# EasyEDA schematic SCH_浩盛单路电机开发板V2.0.json
TITLE: 浩盛单路电机开发板V2.0; REV: 1.0; Date: 2025-05-28; Sheet: 1/1; Drawn By: 嵌入式软件工程师YHR; Company: Your Company
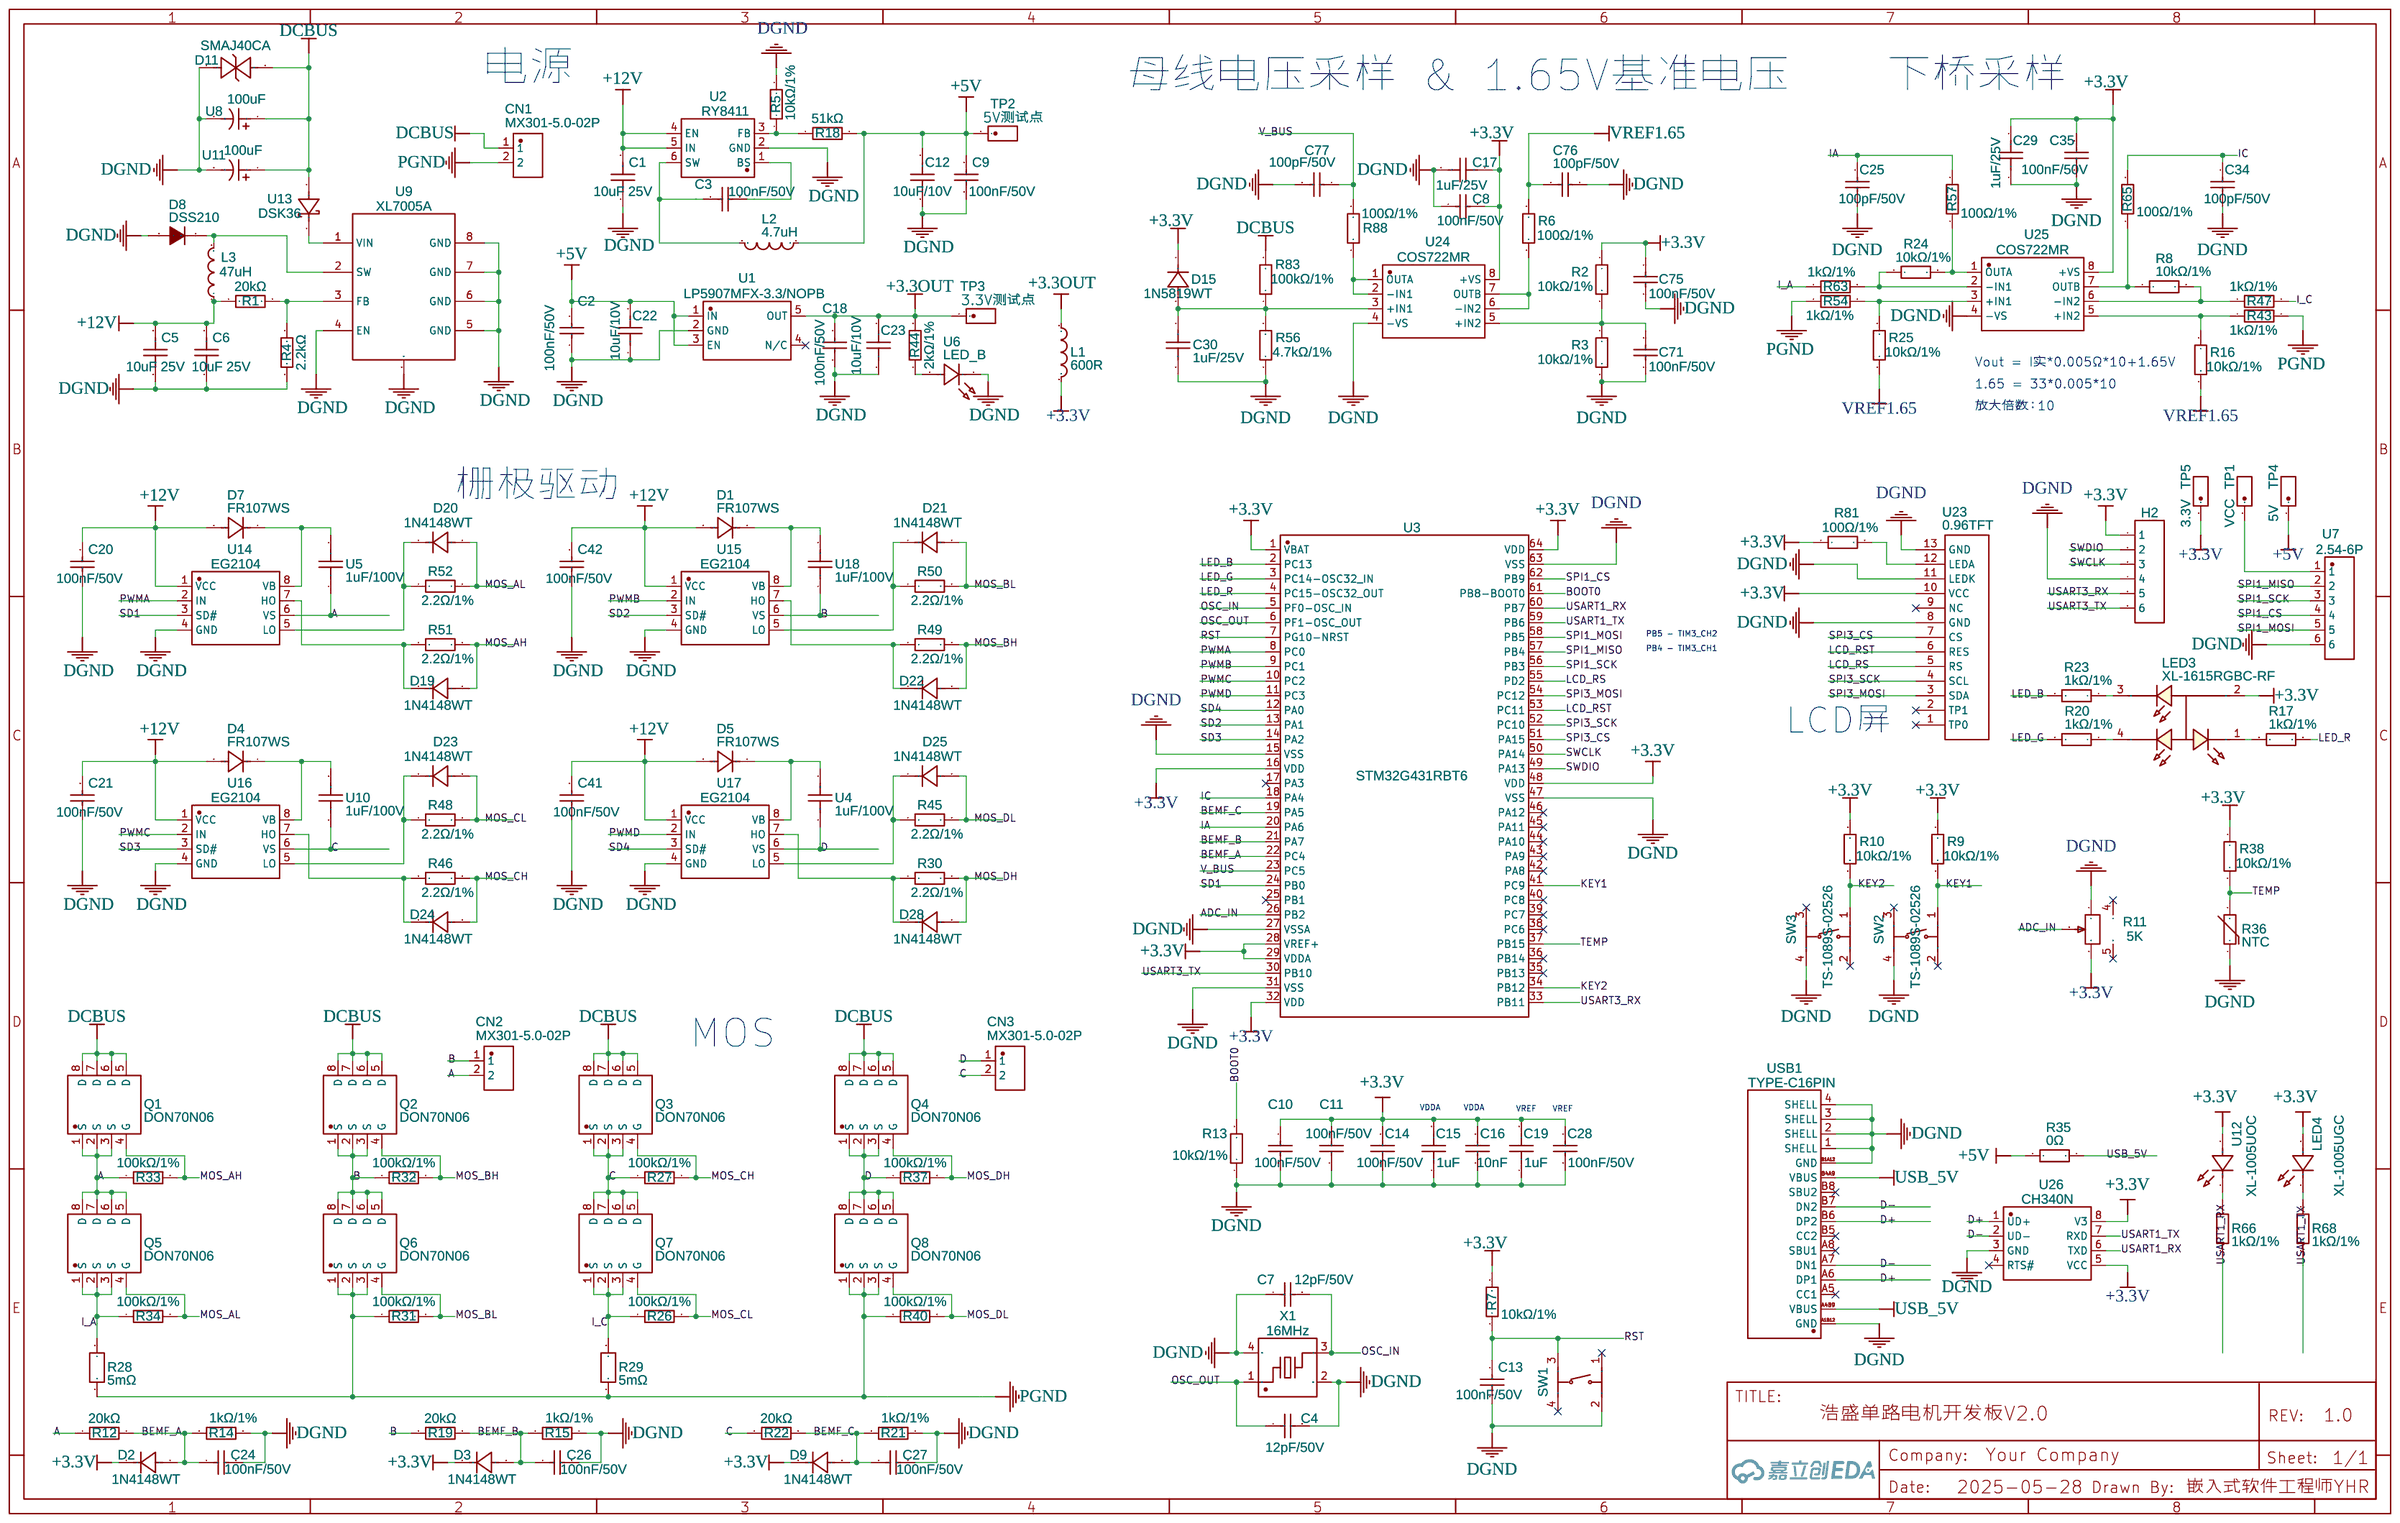
[diagram p0: schematic sheet]

## Parts
C1  10uF 25V  [C0603]
C2  100nF/50V  [MY_0402]
C3  100nF/50V  [MY_0402]
C4  12pF/50V  [MY_0402]
C5  10uF 25V  [C0603]
C6  10uF 25V  [C0603]
C7  12pF/50V  [MY_0402]
C8  100nF/50V  [MY_0402]
C9  100nF/50V  [MY_0402]
C10  100nF/50V  [MY_0402]
C11  100nF/50V  [MY_0402]
C12  10uF/10V  [MY_0402]
C13  100nF/50V  [MY_0402]
C14  100nF/50V  [MY_0402]
C15  1uF  [MY_0402]
C16  10nF  [MY_0402]
C17  1uF/25V  [MY_0402]
C18  100nF/50V  [MY_0402]
C19  1uF  [MY_0402]
C20  100nF/50V  [MY_0402]
C21  100nF/50V  [MY_0402]
C22  10uF/10V  [MY_0402]
C23  10uF/10V  [MY_0402]
C24  100nF/50V  [MY_0402]
C25  100pF/50V  [MY_0402]
C26  100nF/50V  [MY_0402]
C27  100nF/50V  [MY_0402]
C28  100nF/50V  [MY_0402]
C29  1uF/25V  [MY_0402]
C30  1uF/25V  [MY_0402]
C34  100pF/50V  [MY_0402]
C35  100nF/50V  [MY_0402]
C41  100nF/50V  [MY_0402]
C42  100nF/50V  [MY_0402]
C71  100nF/50V  [MY_0402]
C75  100nF/50V  [MY_0402]
C76  100pF/50V  [MY_0402]
C77  100pF/50V  [MY_0402]
CN1  MX301-5.0-02P  [CONN-TH_2P-P5.0-MX301-5.0-02P-BU01-CU-Y-A]
CN2  MX301-5.0-02P  [CONN-TH_2P-P5.0-MX301-5.0-02P-BU01-CU-Y-A]
CN3  MX301-5.0-02P  [CONN-TH_2P-P5.0-MX301-5.0-02P-BU01-CU-Y-A]
D1  FR107WS  [SOD-323_L1.6-W1.3-LS2.7-RD]
D2  1N4148WT  [SOD-523_L1.2-W0.8-LS1.6-RD]
D3  1N4148WT  [SOD-523_L1.2-W0.8-LS1.6-RD]
D4  FR107WS  [SOD-323_L1.6-W1.3-LS2.7-RD]
D5  FR107WS  [SOD-323_L1.6-W1.3-LS2.7-RD]
D7  FR107WS  [SOD-323_L1.6-W1.3-LS2.7-RD]
D8  DSS210  [SOD-123_L2.8-W1.8-LS3.7-FD]
D9  1N4148WT  [SOD-523_L1.2-W0.8-LS1.6-RD]
D11  SMAJ40CA  [SMA_L4.3-W2.6-LS5.0-BI]
D15  1N5819WT  [SOD-523_L1.2-W0.8-LS1.6-RD]
D19  1N4148WT  [SOD-523_L1.2-W0.8-LS1.6-RD]
D20  1N4148WT  [SOD-523_L1.2-W0.8-LS1.6-RD]
D21  1N4148WT  [SOD-523_L1.2-W0.8-LS1.6-RD]
D22  1N4148WT  [SOD-523_L1.2-W0.8-LS1.6-RD]
D23  1N4148WT  [SOD-523_L1.2-W0.8-LS1.6-RD]
D24  1N4148WT  [SOD-523_L1.2-W0.8-LS1.6-RD]
D25  1N4148WT  [SOD-523_L1.2-W0.8-LS1.6-RD]
D28  1N4148WT  [SOD-523_L1.2-W0.8-LS1.6-RD]
H2  Header-Male-2.54_1x6  [HDR-TH_6P-P2.54-V-M-1]
L1  600R  [MY_0402]
L2  4.7uH  [IND-SMD_L4.0-W4.0]
L3  47uH  [IND-SMD_L4.0-W4.0]
LED3  XL-1615RGBC-RF  [LED-ARRAY-SMD_4P-L1.6-W1.5-BR_XL-1615RGBC-RF]
LED4  XL-1005UGC  [LED0402-RD_GREEN]
Q1  DON70N06  [DFN-8_L5.8-W4.9-P1.27-LS6.1-BL-2]
Q2  DON70N06  [DFN-8_L5.8-W4.9-P1.27-LS6.1-BL-2]
Q3  DON70N06  [DFN-8_L5.8-W4.9-P1.27-LS6.1-BL-2]
Q4  DON70N06  [DFN-8_L5.8-W4.9-P1.27-LS6.1-BL-2]
Q5  DON70N06  [DFN-8_L5.8-W4.9-P1.27-LS6.1-BL-2]
Q6  DON70N06  [DFN-8_L5.8-W4.9-P1.27-LS6.1-BL-2]
Q7  DON70N06  [DFN-8_L5.8-W4.9-P1.27-LS6.1-BL-2]
Q8  DON70N06  [DFN-8_L5.8-W4.9-P1.27-LS6.1-BL-2]
R1  20kΩ  [MY_0402]
R2  10kΩ/1%  [MY_0402]
R3  10kΩ/1%  [MY_0402]
R4  2.2kΩ  [MY_0402]
R5  10kΩ/1%  [MY_0402]
R6  100Ω/1%  [MY_0402]
R7  10kΩ/1%  [MY_0402]
R8  10kΩ/1%  [MY_0402]
R9  10kΩ/1%  [MY_0402]
R10  10kΩ/1%  [MY_0402]
R11  5K  [R1001G]
R12  20kΩ  [MY_0402]
R13  10kΩ/1%  [MY_0402]
R14  1kΩ/1%  [MY_0402]
R15  1kΩ/1%  [MY_0402]
R16  10kΩ/1%  [MY_0402]
R17  1kΩ/1%  [MY_0402]
R18  51kΩ  [MY_0402]
R19  20kΩ  [MY_0402]
R20  1kΩ/1%  [MY_0402]
R21  1kΩ/1%  [MY_0402]
R22  20kΩ  [MY_0402]
R23  1kΩ/1%  [MY_0402]
R24  10kΩ/1%  [MY_0402]
R25  10kΩ/1%  [MY_0402]
R26  100kΩ/1%  [MY_0402]
R27  100kΩ/1%  [MY_0402]
R28  5mΩ  [RES-SMD_L6.4-W3.2-1]
R29  5mΩ  [RES-SMD_L6.4-W3.2-1]
R30  2.2Ω/1%  [MY_0402]
R31  100kΩ/1%  [MY_0402]
R32  100kΩ/1%  [MY_0402]
R33  100kΩ/1%  [MY_0402]
R34  100kΩ/1%  [MY_0402]
R35  0Ω  [R0402]
R36  NTC  [MY_0402]
R37  100kΩ/1%  [MY_0402]
R38  10kΩ/1%  [MY_0402]
R40  100kΩ/1%  [MY_0402]
R43  1kΩ/1%  [MY_0402]
R44  2kΩ/1%  [MY_0402]
R45  2.2Ω/1%  [MY_0402]
R46  2.2Ω/1%  [MY_0402]
R47  1kΩ/1%  [MY_0402]
R48  2.2Ω/1%  [MY_0402]
R49  2.2Ω/1%  [MY_0402]
R50  2.2Ω/1%  [MY_0402]
R51  2.2Ω/1%  [MY_0402]
R52  2.2Ω/1%  [MY_0402]
R54  1kΩ/1%  [MY_0402]
R56  4.7kΩ/1%  [MY_0402]
R57  100Ω/1%  [MY_0402]
R63  1kΩ/1%  [MY_0402]
R65  100Ω/1%  [MY_0402]
R66  1kΩ/1%  [MY_0402]
R68  1kΩ/1%  [MY_0402]
R81  100Ω/1%  [MY_0402]
R83  100kΩ/1%  [MY_0402]
R88  100Ω/1%  [MY_0402]
SW1  TS-1089S-02526  [SW-SMD_4P-L4.2-W3.3-P2.15-LS5.1]
SW2  TS-1089S-02526  [SW-SMD_4P-L4.2-W3.3-P2.15-LS5.1]
SW3  TS-1089S-02526  [SW-SMD_4P-L4.2-W3.3-P2.15-LS5.1]
TP1  VCC  [测试点]
TP2  5V测试点  [测试点]
TP3  3.3V测试点  [测试点]
TP4  5V  [测试点]
TP5  3.3V  [测试点]
U1  LP5907MFX-3.3/NOPB  [SOT-23-5_L3.0-W1.7-P0.95-LS2.8-BR]
U2  RY8411  [SOT-23-6_L2.9-W1.6-P0.95-LS2.8-TL]
U3  STM32G431RBT6  [LQFP-64_L10.0-W10.0-P0.50-LS12.0-BL]
U4  1uF/100V  [C0805]
U5  1uF/100V  [C0805]
U6  LED_B  [LED0402-RD]
U7  2.54-6P  [CONN-TH_DB125-2.54-6P-GN]
U8  100uF  [CAP-SMD_BD8.0-L8.3-W8.3-LS9.3-FD-1]
U9  XL7005A  [SOIC-8_L4.9-W3.9-P1.27-LS6.0-BL-EP3.1-1]
U10  1uF/100V  [C0805]
U11  100uF  [CAP-SMD_BD8.0-L8.3-W8.3-LS9.3-FD-1]
U12  XL-1005UOC  [LED0402-RD_ORANGE]
U13  DSK36  [SOD-123FL_L2.8-W1.9-LS3.7-RD]
U14  EG2104  [SOP-8_L5.0-W4.0-P1.27-LS6.2-BL]
U15  EG2104  [SOP-8_L5.0-W4.0-P1.27-LS6.2-BL]
U16  EG2104  [SOP-8_L5.0-W4.0-P1.27-LS6.2-BL]
U17  EG2104  [SOP-8_L5.0-W4.0-P1.27-LS6.2-BL]
U18  1uF/100V  [C0805]
U23  0.96TFT  [0.96寸TFT]
U24  COS722MR  [MSOP-8_L3.0-W3.0-P0.65-LS4.9-BL-1]
U25  COS722MR  [MSOP-8_L3.0-W3.0-P0.65-LS4.9-BL-1]
U26  CH340N  [SOP-8_L5.0-W4.0-P1.27-LS6.0-BL]
USB1  TYPE-C16PIN  [USB-C-SMD_TYPE-C16PIN]
X1  16MHz  [CRYSTAL-SMD_4P-L2.0-W1.6-BL]

## Library data of the parts
C1 C5 C6 = HGC0603R5106M250NTHJ: Supplier: LCSC; Supplier Part: C7472961; Manufacturer: Chinocera(华瓷); Contributor: lcsc; JLCPCB Part Class: Extended Part
C2 C3 C8-C11 C13 C14 C18 C20 C21 C24 C26-C28 C35 C41 C42 C71 C75 = CC0402KRX7R9BB104: Contributor: LCSC; Supplier: LCSC; Supplier Part: C131394; Manufacturer: YAGEO(国巨); JLCPCB Part Class: Extended Part
C4 C7 = CC0402JRNPO9BN120: Supplier: LCSC; Manufacturer: YAGEO(国巨); Supplier Part: C106201; JLCPCB Part Class: Extended Part
C12 C22 C23 = CL05A106MP5NUNC_C315248: Contributor: LCSC; Supplier: LCSC; Supplier Part: C315248; Manufacturer: SAMSUNG(三星); Manufacturer Part: CL05A106MP5NUNC; JLCPCB Part Class: Extended Part
C15 C19 = CC0402KRX5R8BB105: Contributor: LCSC; Supplier: LCSC; Supplier Part: C326568; Manufacturer: YAGEO(国巨); JLCPCB Part Class: Extended Part
C16 = CC0402KRX7R9BB103: Supplier: LCSC; Manufacturer: YAGEO(国巨); Supplier Part: C60133; JLCPCB Part Class: Extended Part
C17 C29 C30 = CL05A105KA5NQNC: Supplier: LCSC; Manufacturer: SAMSUNG(三星); Supplier Part: C52923
C25 C34 C76 C77 = CC0402JRNPO9BN101: Supplier: LCSC; Manufacturer: YAGEO(国巨); Supplier Part: C106200; JLCPCB Part Class: Extended Part
CN1-CN3 = MX301-5.0-02P-BU01-CU-Y-A: Supplier: LCSC; Supplier Part: C5188422; Manufacturer: MAX(迈旭); Manufacturer Part: MX301-5.0-02P-BU01-Cu-Y-A; Contributor: lcsc; JLCPCB Part Class: Extended Part
D1 D4 D5 D7 = FR107WS_C3013756: Contributor: lcsc; Supplier: LCSC; Supplier Part: C3013756; Manufacturer: YFW(佑风微); JLCPCB Part Class: Extended Part
D2 D3 D9 D19-D25 D28 = 1N4148WT_C708767: Supplier: LCSC; Supplier Part: C708767; Manufacturer: TECH PUBLIC(台舟); Contributor: LCSC; JLCPCB Part Class: Extended Part
D8 = DSS210: Contributor: LCSC; Supplier: LCSC; Supplier Part: C511868; Manufacturer: BORN(伯恩半导体); JLCPCB Part Class: Extended Part
D11 = SMAJ40CA_C19077552: Supplier: LCSC; Supplier Part: C19077552; Manufacturer: 宏嘉诚; Contributor: lcsc; JLCPCB Part Class: Extended Part
D15 = 1N5819WT_C5451630: Supplier: LCSC; Supplier Part: C5451630; Manufacturer: HXY MOSFET(华轩阳电子); JLCPCB Part Class: Extended Part; Contributor: lcsc
H2 = Header-Male-2.54_1x6: Supplier: LCSC; Manufacturer: BOOMELE(博穆精密); Manufacturer Part: 2.54-1x6P直针; Supplier Part: C37208; JLCPCB Part Class: Extended Part
L1 = BLM15AG601SN1D: Supplier: LCSC; Manufacturer: muRata(村田); Supplier Part: C76884; JLCPCB Part Class: Extended Part
L2 = FHD4020S-4R7MT: Contributor: LCSC; Supplier: LCSC; Supplier Part: C602031; Manufacturer: cjiang(长江微电); JLCPCB Part Class: Extended Part
L3 = FHD4020S-470MT: Contributor: LCSC; Supplier: LCSC; Supplier Part: C843300; Manufacturer: cjiang(长江微电); JLCPCB Part Class: Extended Part
LED3 = XL-1615RGBC-RF: Contributor: LCSC; Supplier: LCSC; Supplier Part: C965840; Manufacturer: XINGLIGHT(成兴光); JLCPCB Part Class: Extended Part
LED4 = XL-1005UGC: Contributor: LCSC; Supplier: LCSC; Supplier Part: C965793; Manufacturer: XINGLIGHT(成兴光); JLCPCB Part Class: Extended Part
Q1-Q8 = DON70N06: Supplier: LCSC; Supplier Part: C41384263; Manufacturer: DOINGTER(杜因特); Contributor: lcsc; JLCPCB Part Class: Extended Part
R1 R12 R19 R22 = RC0402FR-0720KL: Supplier: LCSC; Manufacturer: YAGEO(国巨); Supplier Part: C93942; JLCPCB Part Class: Extended Part
R2 R3 R5 R7-R10 R13 R16 R24 R25 R38 = RC0402FR-0710KL: Supplier: LCSC; Manufacturer: YAGEO(国巨); Supplier Part: C60490; JLCPCB Part Class: Extended Part
R4 = RC0402FR-072K2L: Supplier: LCSC; Manufacturer: YAGEO(国巨); Supplier Part: C114762; JLCPCB Part Class: Extended Part
R6 R57 R65 R81 R88 = RC0402FR-07100RL: Supplier: LCSC; Manufacturer: YAGEO(国巨); Supplier Part: C106232; JLCPCB Part Class: Extended Part
R11 = R1001-B502-3P 18mm: Supplier: LCSC; Manufacturer: null; Supplier Part: C10529; JLCPCB Part Class: Extended Part
R14 R15 R17 R20 R21 R23 R66 R68 = RC0402FR-071KL: Supplier: LCSC; Manufacturer: YAGEO(国巨); Supplier Part: C106235; JLCPCB Part Class: Extended Part
R18 = RC0402FR-0751KL: Supplier: LCSC; Manufacturer: YAGEO(国巨); Supplier Part: C107229; JLCPCB Part Class: Extended Part
R26 R27 R31-R34 R37 R40 R83 = RC0402FR-07100KL: Supplier: LCSC; Manufacturer: YAGEO(国巨); Supplier Part: C60491; JLCPCB Part Class: Extended Part
R28 R29 = HOJLR2512-3W-5MR-1%: Contributor: LCSC; Supplier: LCSC; Supplier Part: C2903482; Manufacturer: Milliohm(毫欧); Manufacturer Part: HoJLR2512-3W-5mR-1%; JLCPCB Part Class: Extended Part
R30 R45 R46 R48-R52 = RC0402FR-072R2L: Contributor: LCSC; Supplier: LCSC; Supplier Part: C327251; Manufacturer: YAGEO(国巨); JLCPCB Part Class: Extended Part
R35 = 0402WGF0000TCE: Supplier: LCSC; Manufacturer: UNI-ROYAL(厚声); Supplier Part: C17168; JLCPCB Part Class: Basic Part
R36 = NCP15XH103F03RC: Supplier: LCSC; Manufacturer: muRata(村田); Supplier Part: C77131; JLCPCB Part Class: Extended Part
R43 R47 R54 R63 = RT0402BRD071K5L: Contributor: LCSC; Supplier: LCSC; Supplier Part: C106235; Manufacturer: YAGEO(国巨); Manufacturer Part: RC0402FR-071KL; JLCPCB Part Class: Extended Part
R44 = RC0402FR-072KL: Supplier: LCSC; Manufacturer: YAGEO(国巨); Supplier Part: C60488; JLCPCB Part Class: Extended Part
R56 = RC0402FR-074K7L: Supplier: LCSC; Manufacturer: YAGEO(国巨); Supplier Part: C105871; JLCPCB Part Class: Extended Part
SW1-SW3 = TS-1089S-02526: Contributor: LCSC; Supplier: LCSC; Supplier Part: C455282; Manufacturer: XUNPU(讯普); JLCPCB Part Class: Extended Part
TP1-TP5 = 测试点: Contributor: fslwcndyd
U1 = LP5907MFX-3.3/NOPB: Contributor: LCSC; Supplier: LCSC; Supplier Part: C80670; Manufacturer: TI(德州仪器); JLCPCB Part Class: Extended Part
U2 = RY8411_C2935411: Contributor: LCSC; Supplier: LCSC; Supplier Part: C2935411; Manufacturer: RYCHiP(蕊源); JLCPCB Part Class: Extended Part
U3 = STM32G431RBT6: Contributor: LCSC; Supplier: LCSC; Supplier Part: C431633; Manufacturer: ST(意法半导体); JLCPCB Part Class: Extended Part
U4 U5 U10 U18 = CC0805KKX7R0BB105: Supplier: LCSC; Supplier Part: C5370002; Manufacturer: YAGEO(国巨); JLCPCB Part Class: Extended Part; Contributor: lcsc; link: https://so.szlcsc.com/global.html?k=C5370002&ref=editor
U6 = XL-1005UBC_C22355736: Supplier: LCSC; Supplier Part: C22355736; Manufacturer: XINGLIGHT(成兴光); Manufacturer Part: XL-1005UBC; JLCPCB Part Class: Extended Part; Contributor: lcsc
U7 = DB125-2.54-6P-GN: Contributor: LCSC; Supplier: LCSC; Supplier Part: C918124; Manufacturer: DORABO(地博电气); Manufacturer Part: DB125-2.54-6P-GN-S; JLCPCB Part Class: Extended Part
U8 U11 = 189RV0092: Supplier: LCSC; Supplier Part: C18203172; Manufacturer: KNSCHA(科尼盛); JLCPCB Part Class: Extended Part; Contributor: lcsc
U9 = XL7005A: Supplier: LCSC; Manufacturer: XLSEMI(芯龙); Supplier Part: C50848; JLCPCB Part Class: Extended Part
U12 = XL-1005UOC: Supplier: LCSC; Supplier Part: C965791; Manufacturer: XINGLIGHT(成兴光); JLCPCB Part Class: Extended Part; Contributor: lcsc
U13 = DSK36_C22466353: Supplier: LCSC; Supplier Part: C22466353; Manufacturer: 宏嘉诚; Contributor: lcsc; JLCPCB Part Class: Extended Part
U14-U17 = EG2104: Supplier: LCSC; Supplier Part: C186697; Manufacturer: EG Micro; Contributor: LCSC; JLCPCB Part Class: Extended Part
U23 = 0.96TFT: Contributor: lovegjy; Package Display: No
U24 U25 = COS722MR: Contributor: LCSC; Supplier: LCSC; Supplier Part: C726653; Manufacturer: COSINE(科山芯创); JLCPCB Part Class: Extended Part
U26 = CH340N: Supplier: LCSC; Supplier Part: C506813; Manufacturer: WCH(Jiangsu Qin Heng); Contributor: LCSC; JLCPCB Part Class: Extended Part; subpart_no: 1
USB1 = TYPE-C16PIN: Supplier: LCSC; Supplier Part: C393939; Manufacturer: SHOU HAN; Contributor: LCSC; JLCPCB Part Class: Extended Part
X1 = XL7EL89COI-111YLC-16M: Supplier: LCSC; Supplier Part: C2965579; Manufacturer: YXC(扬兴晶振); JLCPCB Part Class: Extended Part; Contributor: lcsc

## Nets
+3.3V: C8.2 C10.2 C11.2 C14.2 C15.2 C16.2 C17.1 C19.2 C28.2 C29.2 C35.1 C75.2 D2.1(K) D3.1(K) D9.1(K) D15.1(K) H2.1 L1.2 LED3.2(COM+) LED4.2(A) R2.1 R7.2 R9.1 R10.1 R11.3 R38.1 R81.1 TP5.1 U3.1(VBAT) U3.16(VDD) U3.28(VREF+) U3.29(VDDA) U3.32(VDD) U3.48(VDD) U3.64(VDD) U12.2(A) U23.10(VCC) U24.8(+VS) U25.8(+VS) U26.5(VCC) U26.8(V3)
+5V: C2.2 C9.2 C12.2 C22.2 L2.1 R18.2 R35.1 TP2.1 TP4.1 U1.1(IN) U1.3(EN)
+12V: C1.2 C5.2 C6.2 C20.2 C21.2 C41.2 C42.2 D1.2(A) D4.2(A) D5.2(A) D7.2(A) L3.1 R1.1 U2.4(EN) U2.5(IN) U14.1(VCC) U15.1(VCC) U16.1(VCC) U17.1(VCC)
DGND: C1.1 C2.1 C4.2 C5.1 C6.1 C7.1 C8.1 C9.1 C10.1 C11.1 C12.1 C13.2 C14.1 C15.1 C16.1 C17.2 C18.1 C19.1 C20.1 C21.1 C22.1 C23.2 C24.2 C25.1 C26.2 C27.2 C28.1 C29.1 C30.2 C34.1 C35.2 C41.1 C42.1 C71.1 C75.1 C76.1 C77.2 D8.1(A) D11.1 H2.4 R3.2 R4.1 R5.2 R11.1 R13.1 R14.1 R15.1 R21.1 R36.1 R56.1 SW1.2 SW2.4 SW3.4 U1.2(GND) U2.2(GND) U3.15(VSS) U3.27(VSSA) U3.31(VSS) U3.47(VSS) U3.63(VSS) U6.1(K) U7.6 U8.2 U9.4(EN) U9.5(GND) U9.6(GND) U9.7(GND) U9.8(GND) U9.9 U11.2 U14.4(GND) U15.4(GND) U16.4(GND) U17.4(GND) U23.8(GND) U23.11(LEDK) U23.13(GND) U24.4(-VS) U25.4(-VS) U26.3(GND) USB1.1(SHELL) USB1.2(SHELL) USB1.3(SHELL) USB1.4(SHELL) USB1.A1B12(GND) USB1.B1A12(GND) X1.2(GND) X1.4(GND)
PGND: CN1.2 Q6.1(S) Q6.2(S) Q6.3(S) Q8.1(S) Q8.2(S) Q8.3(S) R28.1 R29.1 R31.1 R40.1 R43.2 R54.1
+3.3OUT: C18.2 C23.1 L1.1 R44.2 TP3.1 U1.5(OUT)
A: CN2.2 Q1.1(S) Q1.2(S) Q1.3(S) Q5.5(D) Q5.6(D) Q5.7(D) Q5.8(D) R12.1 R33.1 U5.1 U14.6(VS)
ADC_IN: R11.2 U3.26(PB2)
B: CN2.1 Q2.1(S) Q2.2(S) Q2.3(S) Q6.5(D) Q6.6(D) Q6.7(D) Q6.8(D) R19.1 R32.1 U15.6(VS) U18.1
BEMF_A: C24.1 D2.2(A) R12.2 R14.2 U3.22(PC4)
BEMF_B: C26.1 D3.2(A) R15.2 R19.2 U3.21(PA7)
BEMF_C: C27.1 D9.2(A) R21.2 R22.2 U3.19(PA5)
BOOT0: R13.2 U3.61(PB8-BOOT0)
C: CN3.2 Q3.1(S) Q3.2(S) Q3.3(S) Q7.5(D) Q7.6(D) Q7.7(D) Q7.8(D) R22.1 R27.1 U10.1 U16.6(VS)
D: CN3.1 Q4.1(S) Q4.2(S) Q4.3(S) Q8.5(D) Q8.6(D) Q8.7(D) Q8.8(D) R37.1 U4.1 U17.6(VS)
D+: U26.1(UD+) USB1.A6(DP1) USB1.B6(DP2)
D-: U26.2(UD-) USB1.A7(DN1) USB1.B7(DN2)
DCBUS: CN1.1 D11.2 Q1.5(D) Q1.6(D) Q1.7(D) Q1.8(D) Q2.5(D) Q2.6(D) Q2.7(D) Q2.8(D) Q3.5(D) Q3.6(D) Q3.7(D) Q3.8(D) Q4.5(D) Q4.6(D) Q4.7(D) Q4.8(D) R83.2 U8.1 U11.1 U13.2(A)
I_A: Q5.1(S) Q5.2(S) Q5.3(S) R28.2 R34.1 R63.1
I_C: Q7.1(S) Q7.2(S) Q7.3(S) R26.1 R29.2 R47.2
IA: C25.2 R57.2 U3.20(PA6)
IC: C34.2 R65.2 U3.18(PA4)
KEY1: R9.2 SW2.1 U3.41(PC9)
KEY2: R10.2 SW3.1 U3.34(PB12)
LCD_RS: U3.55(PD2) U23.5(RS)
LCD_RST: U3.53(PC11) U23.6(RES)
LED_B: R23.2 U3.2(PC13)
LED_G: R20.2 U3.3(PC14-OSC32_IN)
LED_R: R17.1 U3.4(PC15-OSC32_OUT)
MOS_AH: D19.2(A) Q1.4(G) R33.2 R51.2
MOS_AL: D20.2(A) Q5.4(G) R34.2 R52.2
MOS_BH: D22.2(A) Q2.4(G) R32.2 R49.2
MOS_BL: D21.2(A) Q6.4(G) R31.2 R50.2
MOS_CH: D24.2(A) Q3.4(G) R27.2 R46.2
MOS_CL: D23.2(A) Q7.4(G) R26.2 R48.2
MOS_DH: D28.2(A) Q4.4(G) R30.2 R37.2
MOS_DL: D25.2(A) Q8.4(G) R40.2 R45.2
OSC_IN: C7.2 U3.5(PF0-OSC_IN) X1.3
OSC_OUT: C4.1 U3.6(PF1-OSC_OUT) X1.1
PWMA: U3.8(PC0) U14.2(IN)
PWMB: U3.9(PC1) U15.2(IN)
PWMC: U3.10(PC2) U16.2(IN)
PWMD: U3.11(PC3) U17.2(IN)
RST: C13.1 R7.1 SW1.3 U3.7(PG10-NRST)
SD1: U3.24(PB0) U14.3(SD#)
SD2: U3.13(PA1) U15.3(SD#)
SD3: U3.14(PA2) U16.3(SD#)
SD4: U3.12(PA0) U17.3(SD#)
SPI1_CS: U3.62(PB9) U7.4
SPI1_MISO: U3.57(PB4) U7.2
SPI1_MOSI: U3.58(PB5) U7.5
SPI1_SCK: U3.56(PB3) U7.3
SPI3_CS: U3.51(PA15) U23.7(CS)
SPI3_MOSI: U3.54(PC12) U23.3(SDA)
SPI3_SCK: U3.52(PC10) U23.4(SCL)
SWCLK: H2.3 U3.50(PA14)
SWDIO: H2.2 U3.49(PA13)
TEMP: R36.2 R38.2 U3.37(PB15)
USART1_RX: R66.1 U3.60(PB7) U26.6(TXD)
USART1_TX: R68.1 U3.59(PB6) U26.7(RXD)
USART3_RX: H2.5 U3.33(PB11)
USART3_TX: H2.6 U3.30(PB10)
USB_5V: R35.2 USB1.A4B9(VBUS) USB1.B4A9(VBUS)
V_BUS: C77.1 R88.2 U3.23(PC5)
VREF1.65: C76.2 R6.2 R16.2 R25.2
Net-(C3-1): C3.1 U2.1(BS)
Net-(C3-2): C3.2 L2.2 U2.6(SW)
Net-(C30-1): C30.1 D15.2(A) R56.2 R83.1 U24.3(+IN1)
Net-(C71-2): C71.2 R2.2 R3.1 U24.5(+IN2)
Net-(D1-1): D1.1(K) U15.8(VB) U18.2
Net-(D4-1): D4.1(K) U10.2 U16.8(VB)
Net-(D5-1): D5.1(K) U4.2 U17.8(VB)
Net-(D7-1): D7.1(K) U5.2 U14.8(VB)
Net-(D8-2): D8.2(K) L3.2 U9.2(SW)
Net-(D19-1): D19.1(K) R51.1 U14.7(HO)
Net-(D20-1): D20.1(K) R52.1 U14.5(LO)
Net-(D21-1): D21.1(K) R50.1 U15.5(LO)
Net-(D22-1): D22.1(K) R49.1 U15.7(HO)
Net-(D23-1): D23.1(K) R48.1 U16.5(LO)
Net-(D24-1): D24.1(K) R46.1 U16.7(HO)
Net-(D25-1): D25.1(K) R45.1 U17.5(LO)
Net-(D28-1): D28.1(K) R30.1 U17.7(HO)
Net-(LED3-1): LED3.1(R-) R17.2
Net-(LED3-3): LED3.3(B-) R23.1
Net-(LED3-4): LED3.4(G-) R20.1
Net-(LED4-1): LED4.1(K) R68.2
Net-(R1-2): R1.2 R4.2 U9.3(FB)
Net-(R5-1): R5.1 R18.1 U2.3(FB)
Net-(R6-1): R6.1 U24.6(-IN2) U24.7(OUTB)
Net-(R8-1): R8.1 R65.1 U25.7(OUTB)
Net-(R8-2): R8.2 R47.1 U25.6(-IN2)
Net-(R16-1): R16.1 R43.1 U25.5(+IN2)
Net-(R24-1): R24.1 R63.2 U25.2(-IN1)
Net-(R24-2): R24.2 R57.1 U25.1(OUTA)
Net-(R25-1): R25.1 R54.2 U25.3(+IN1)
Net-(R44-1): R44.1 U6.2(A)
Net-(R66-2): R66.2 U12.1(K)
Net-(R81-2): R81.2 U23.12(LEDA)
Net-(R88-1): R88.1 U24.1(OUTA) U24.2(-IN1)
Net-(TP1-1): TP1.1 U7.1
Net-(U9-1): U9.1(VIN) U13.1(K)

Not connected (* = marked no-connect by the designer): R11 4* 5*; SW1 1* 4*; SW2 2* 3*; SW3 2* 3*; U1 4(N/C)*; U3 17(PA3)* 25(PB1)* 35(PB13)* 36(PB14)* 38(PC6)* 39(PC7)* 40(PC8)* 42(PA8)* 43(PA9)* 44(PA10)* 45(PA11)* 46(PA12)*; U23 1(TP0)* 2(TP1)* 9(NC)*; U26 4(RTS#)*; USB1 A5(CC1)* A8(SBU1)* B5(CC2)* B8(SBU2)*

## Notes on the sheet
- 电源
- 母线电压采样 & 1.65V基准电压
- 下桥采样
- Vout = I实*0.005Ω*10+1.65V
- 1.65 = 33*0.005*10
- 放大倍数：10
- 栅极驱动
- PB5 - TIM3_CH2
- PB4 - TIM3_CH1
- LCD屏
- MOS
- VDDA
- VDDA
- VREF
- VREF
